# EAGLE schematic harp timestamp generator Gen3 (EAGLE 9.6.2)
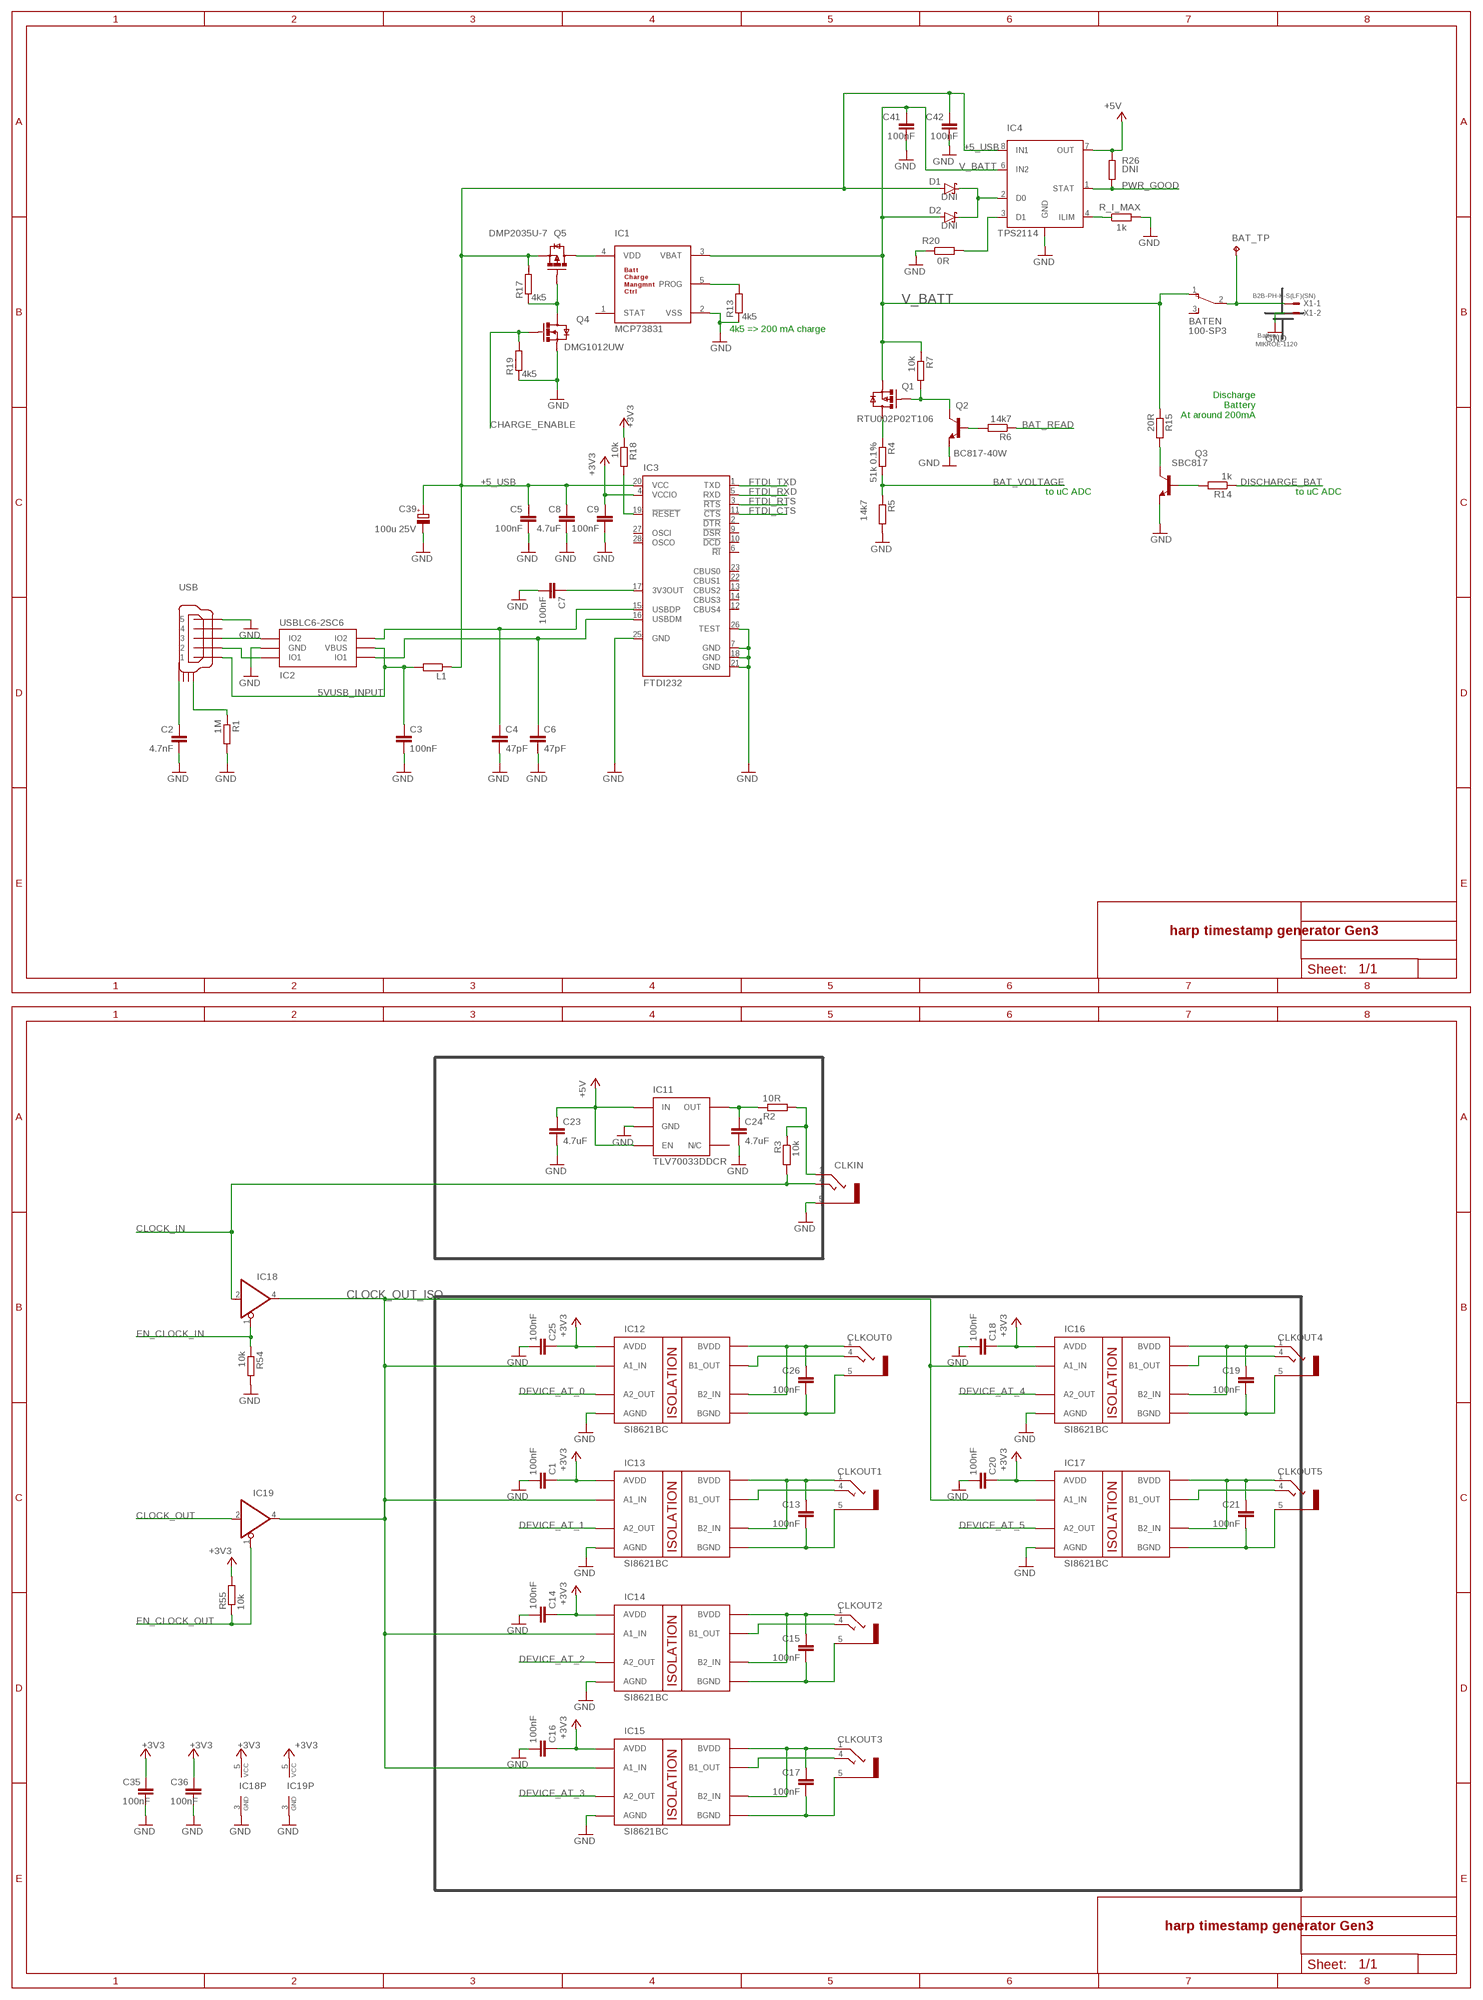
[diagram p0: schematic, sheet 1, part 1 of 2]
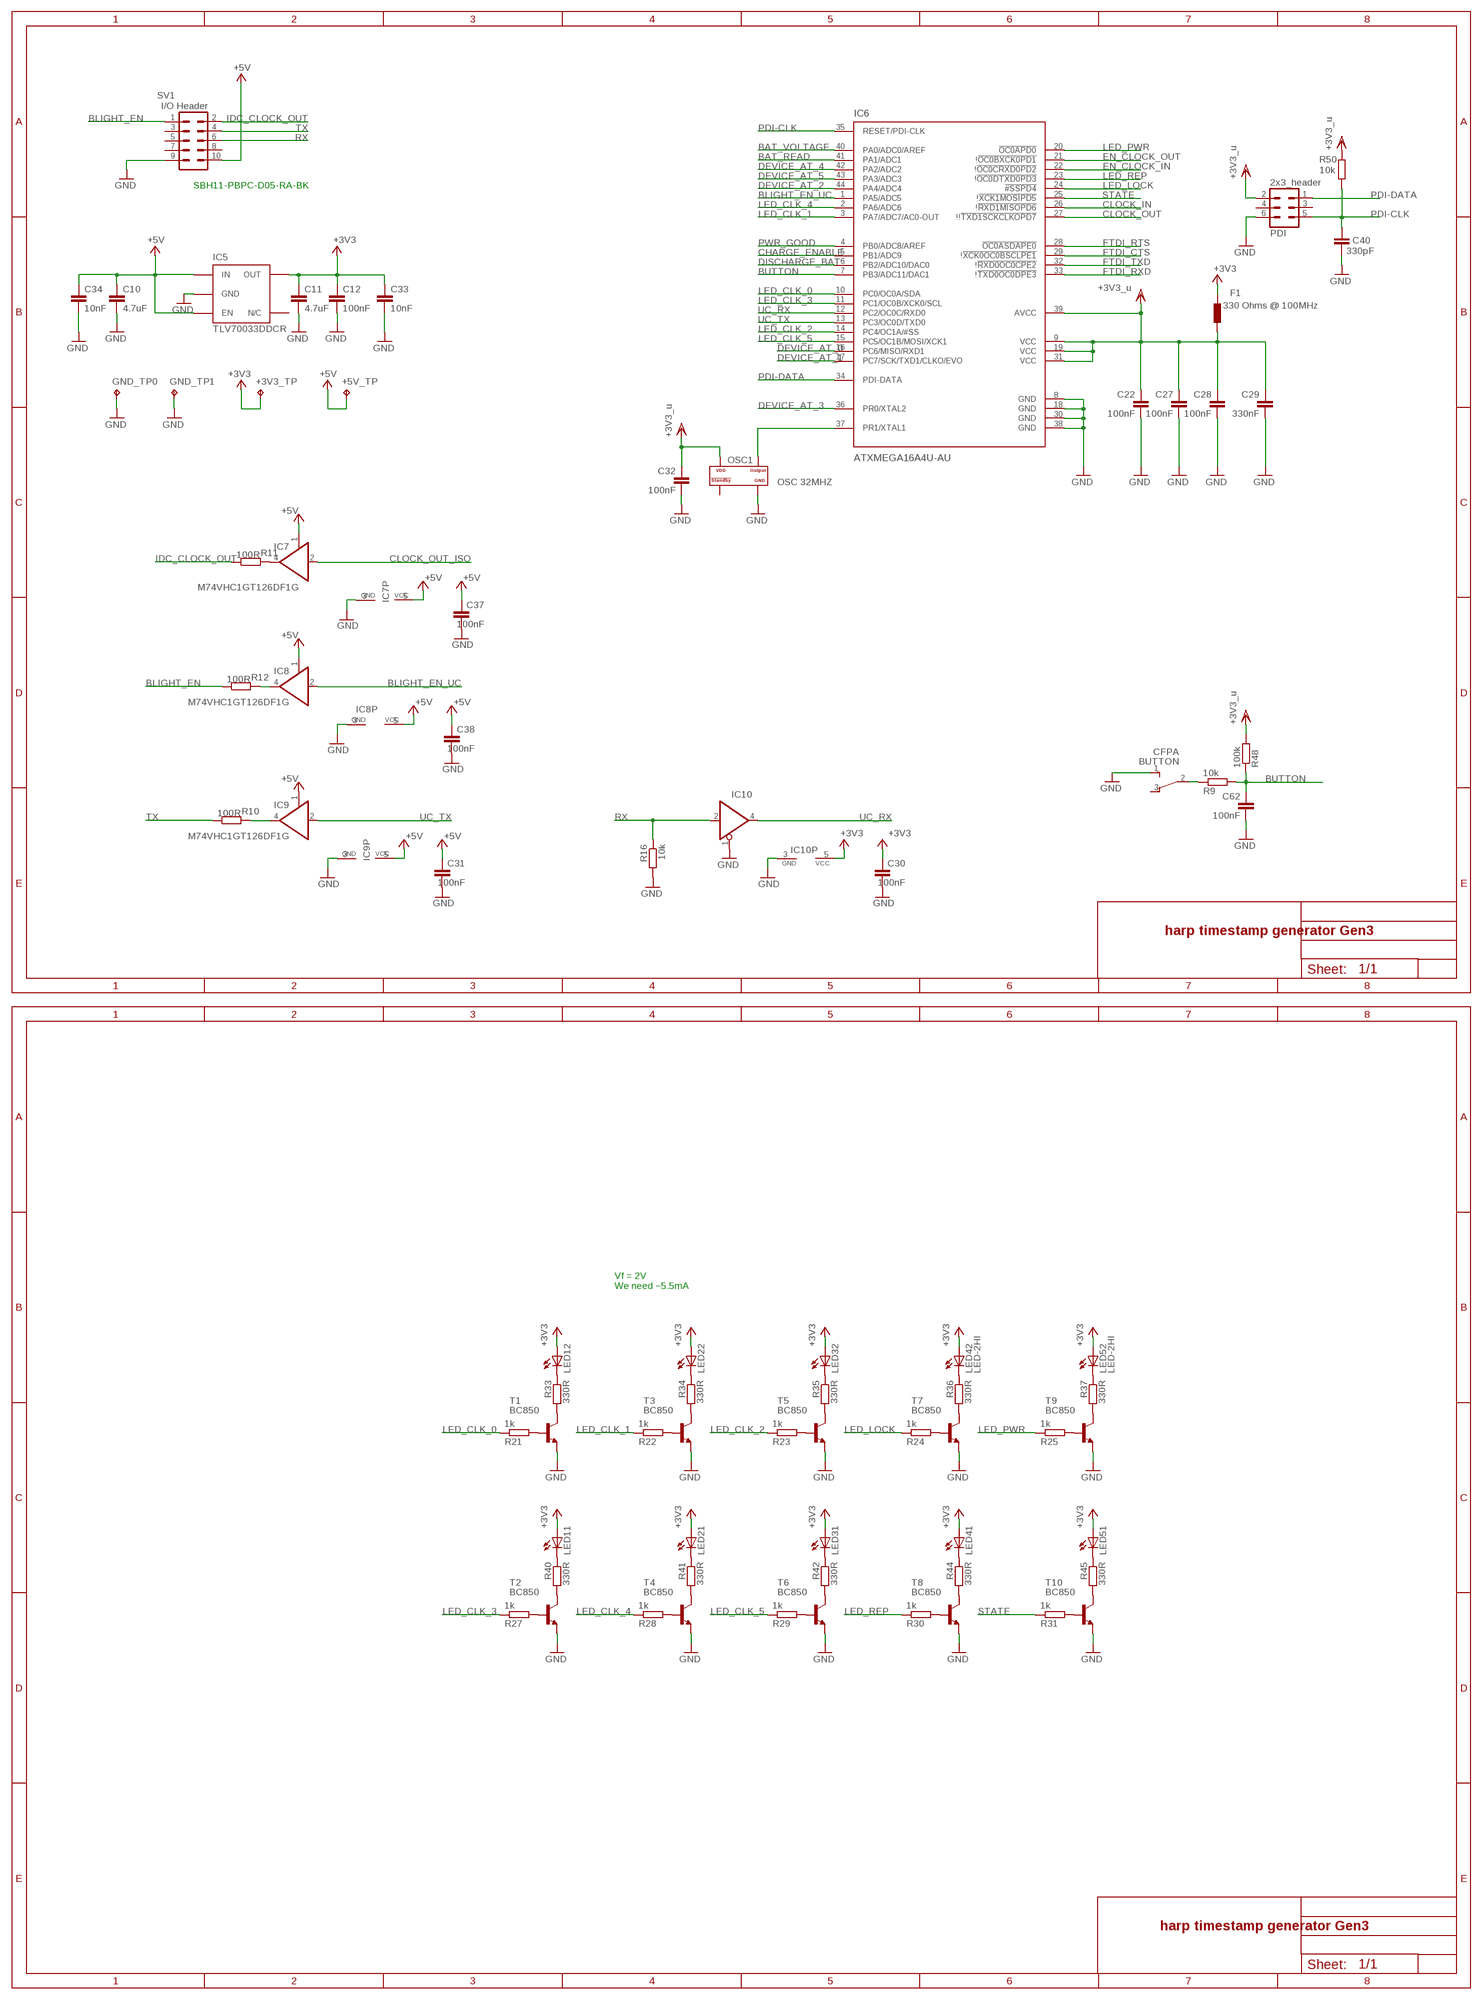
[diagram p1: schematic, sheet 1, part 2 of 2]

## Parts
+3V3_TP  TPPAD1-13  [P1-13]
+5V_TP  TPPAD1-13  [P1-13]
BAT_TP  TPPAD1-13  [P1-13]
BATEN  100-SP3  SPDT_2M-WITHOFF  [2M1-SP1-T2-B4-M6RE]
BUTTON  CFPA  SPDT_CFPA  [CFPA]
C1  100nF  C-EUC0402  [C0402]
C2  4.7nF  C-EUC0402  [C0402]
C3  100nF  C-EUC0402  [C0402]
C4  47pF  C-EUC0402  [C0402]
C5  100nF  C-EUC0402  [C0402]
C6  47pF  C-EUC0402  [C0402]
C7  100nF  C-EUC0402  [C0402]
C8  4.7uF  C-EUC0603  [C0603]
C9  100nF  C-EUC0402  [C0402]
C10  4.7uF  C-EUC0603  [C0603]
C11  4.7uF  C-EUC0603  [C0603]
C12  100nF  C-EUC0402  [C0402]
C13  100nF  C-EUC0402  [C0402]
C14  100nF  C-EUC0402  [C0402]
C15  100nF  C-EUC0402  [C0402]
C16  100nF  C-EUC0402  [C0402]
C17  100nF  C-EUC0402  [C0402]
C18  100nF  C-EUC0402  [C0402]
C19  100nF  C-EUC0402  [C0402]
C20  100nF  C-EUC0402  [C0402]
C21  100nF  C-EUC0402  [C0402]
C22  100nF  C-EUC0402  [C0402]
C23  4.7uF  C-EUC0603  [C0603]
C24  4.7uF  C-EUC0603  [C0603]
C25  100nF  C-EUC0402  [C0402]
C26  100nF  C-EUC0402  [C0402]
C27  100nF  C-EUC0402  [C0402]
C28  100nF  C-EUC0402  [C0402]
C29  330nF  C-EUC0402  [C0402]
C30  100nF  C-EUC0402  [C0402]
C31  100nF  C-EUC0402  [C0402]
C32  100nF  C-EUC0402  [C0402]
C33  10nF  C-EUC0402  [C0402]
C34  10nF  C-EUC0402  [C0402]
C35  100nF  C-EUC0402  [C0402]
C36  100nF  C-EUC0402  [C0402]
C37  100nF  C-EUC0402  [C0402]
C38  100nF  C-EUC0402  [C0402]
C39  100u 25V  CPOL-EUTT2D6  [TT2D6]
C40  330pF  C-EUC0402  [C0402]
C41  100nF  C-EUC0402  [C0402]
C42  100nF  C-EUC0402  [C0402]
C62  100nF  C-EUC0402  [C0402]
CLKIN  CLCK_JACK  STEREO_JACK  [35RASMT2BHNTRX]
CLKOUT0  CLCK_JACK  STEREO_JACK  [35RASMT2BHNTRX]
CLKOUT1  CLCK_JACK  STEREO_JACK  [35RASMT2BHNTRX]
CLKOUT2  CLCK_JACK  STEREO_JACK  [35RASMT2BHNTRX]
CLKOUT3  CLCK_JACK  STEREO_JACK  [35RASMT2BHNTRX]
CLKOUT4  CLCK_JACK  STEREO_JACK  [35RASMT2BHNTRX]
CLKOUT5  CLCK_JACK  STEREO_JACK  [35RASMT2BHNTRX]
D1  DNI  MBRM120  [SOD3715X135]
D2  DNI  MBRM120  [SOD3715X135]
F1  330 Ohms @ 100MHz  BLM15HF0603  [R0603]
GND_TP0  TPPAD1-13  [P1-13]
GND_TP1  TPPAD1-13  [P1-13]
IC1  MCP73831  MCP73831T-2ATI/OT  [TSOT23-5]
IC2  USBLC6-2SC6  USBLC6-2  [SOT23-6L]
IC3  FTDI232  FT232RL  [SSOP28]
IC4  TPS2114  [TSSOP8]
IC5  TLV70033DDCR  TLV700XX  [TSOT23-5]
IC6  ATXMEGA16A4U-AU  AT-XMEGA-XXA4-AU  [QFP80P1200X1200X120-44N]
IC7  M74VHC1GT126DF1G  74AHC1G126DCK  [SC70-5]
IC8  M74VHC1GT126DF1G  74AHC1G126DCK  [SC70-5]
IC9  M74VHC1GT126DF1G  74AHC1G126DCK  [SC70-5]
IC10  SN74LVC1G125DBVT  74AHC1G125DBV  [SOT23-5]
IC11  TLV70033DDCR  TLV700XX  [TSOT23-5]
IC12  SI8621BC  SI8621BC-B-IS  [SOIC8]
IC13  SI8621BC  SI8621BC-B-IS  [SOIC8]
IC14  SI8621BC  SI8621BC-B-IS  [SOIC8]
IC15  SI8621BC  SI8621BC-B-IS  [SOIC8]
IC16  SI8621BC  SI8621BC-B-IS  [SOIC8]
IC17  SI8621BC  SI8621BC-B-IS  [SOIC8]
IC18  SN74LVC1G125DBVT  74AHC1G125DBV  [SOT23-5]
IC19  SN74LVC1G125DBVT  74AHC1G125DBV  [SOT23-5]
L1  40R@100MHz  R-EU_R0805  [R0805]
LED1  LED-2HI  LED_2X_VERTICAL  [569-011X-X00_LED_ARRAY]
LED2  LED-2HI  LED_2X_VERTICAL  [569-011X-X00_LED_ARRAY]
LED3  LED-2HI  LED_2X_VERTICAL  [569-011X-X00_LED_ARRAY]
LED4  LED-2HI  LED_2X_VERTICAL  [569-011X-X00_LED_ARRAY]
LED5  LED-2HI  LED_2X_VERTICAL  [569-011X-X00_LED_ARRAY]
OSC1  OSC 32MHZ  OSCILLATOR  [OSCILLATOR_3.2X2.5]
PDI  2x3_header  MA03-2  [MA03-2]
Q1  RTU002P02T106  MOSFET-PCHANNEL-ROHM  [SOT323]
Q2  BC817-40W  BC817  [SOT323-BEC]
Q3  SBC817  BC817-40LT1SMD  [SOT23-BEC]
Q4  DMG1012UW  [SOT323]
Q5  DMP2035U-7  [SOT323]
R1  1M  R-EU_R0402  [R0402]
R2  10R  R-EU_R0402  [R0402]
R3  10k  R-EU_R0402  [R0402]
R4  51k 0.1%  R-EU_R0402  [R0402]
R5  14k7  R-EU_R0402  [R0402]
R6  14k7  R-EU_R0402  [R0402]
R7  10k  R-EU_R0402  [R0402]
R9  10k  R-EU_R0402  [R0402]
R10  100R  R-EU_R0603  [R0603]
R11  100R  R-EU_R0603  [R0603]
R12  100R  R-EU_R0603  [R0603]
R13  4k5  R-EU_R0402  [R0402]
R14  1k  R-EU_R0402  [R0402]
R15  20R  R-EU_R2512  [R2512]
R16  10k  R-EU_R0402  [R0402]
R17  4k5  R-EU_R0402  [R0402]
R18  10k  R-EU_R0402  [R0402]
R19  4k5  R-EU_R0402  [R0402]
R20  0R  R-EU_R0402  [R0402]
R21  1k  R-EU_R0402  [R0402]
R22  1k  R-EU_R0402  [R0402]
R23  1k  R-EU_R0402  [R0402]
R24  1k  R-EU_R0402  [R0402]
R25  1k  R-EU_R0402  [R0402]
R26  DNI  R-EU_R0402  [R0402]
R27  1k  R-EU_R0402  [R0402]
R28  1k  R-EU_R0402  [R0402]
R29  1k  R-EU_R0402  [R0402]
R30  1k  R-EU_R0402  [R0402]
R31  1k  R-EU_R0402  [R0402]
R33  330R  R-EU_R0402  [R0402]
R34  330R  R-EU_R0402  [R0402]
R35  330R  R-EU_R0402  [R0402]
R36  330R  R-EU_R0402  [R0402]
R37  330R  R-EU_R0402  [R0402]
R40  330R  R-EU_R0402  [R0402]
R41  330R  R-EU_R0402  [R0402]
R42  330R  R-EU_R0402  [R0402]
R44  330R  R-EU_R0402  [R0402]
R45  330R  R-EU_R0402  [R0402]
R48  100k  R-EU_R0402  [R0402]
R50  10k  R-EU_R0402  [R0402]
R54  10k  R-EU_R0402  [R0402]
R55  10k  R-EU_R0402  [R0402]
R_I_MAX  1k  R-EU_R0402  [R0402]
SV1  I/O Header  ML10L  [ML10L]
T1  BC850  [SOT23]
T2  BC850  [SOT23]
T3  BC850  [SOT23]
T4  BC850  [SOT23]
T5  BC850  [SOT23]
T6  BC850  [SOT23]
T7  BC850  [SOT23]
T8  BC850  [SOT23]
T9  BC850  [SOT23]
T10  BC850  [SOT23]
USB  mini USB  USB_MINI_B  [240-0002-1]
X1  B2B-PH-K-S(LF)(SN)  JST-XH-02-PIN-ROUND-PAD  [JST-XH-02-PACKAGE-ROUND-PAD]

## Nets
5VUSB_INPUT: C3.1 IC2.P$5(VBUS) L1.2 USB.P$1
+3V3: +3V3_TP.TP C1.1 C9.1 C11.1 C12.1 C14.1 C16.1 C18.1 C20.1 C25.1 C30.1 C33.1 C35.1 C36.1 F1.2 IC3.4(VCCIO) IC5.5(OUT) IC10.5(VCC) IC12.1(AVDD) IC13.1(AVDD) IC14.1(AVDD) IC15.1(AVDD) IC16.1(AVDD) IC17.1(AVDD) IC18.5(VCC) IC19.5(VCC) LED1.A1(1:A) LED1.A2(2:A) LED2.A1(1:A) LED2.A2(2:A) LED3.A1(1:A) LED3.A2(2:A) LED4.A1(1:A) LED4.A2(2:A) LED5.A1(1:A) LED5.A2(2:A) R18.1 R55.2
+5_USB: C5.1 C8.1 C39.+ C42.1 D1.2(A) IC3.20(VCC) IC4.8(IN1) L1.1 Q5.1(S) R17.2
+5V: +5V_TP.TP C10.1 C23.1 C31.1 C34.1 C37.1 C38.1 IC4.7(OUT) IC5.1(IN) IC5.3(EN) IC7.1(OE) IC7.5(VCC) IC8.1(OE) IC8.5(VCC) IC9.1(OE) IC9.5(VCC) IC11.1(IN) IC11.3(EN) R26.1 SV1.10
BAT_READ: IC6.41(PA1/ADC1) R6.1
BAT_VOLTAGE: IC6.40(PA0/ADC0/AREF) R4.2 R5.1
BLIGHT_EN: R12.1 SV1.1
BLIGHT_EN_UC: IC6.1(PA5/ADC5) IC8.2(I)
BUTTON: C62.1 IC6.7(PB3/ADC11/DAC1) R9.2 R48.1
CHARGE_ENABLE: IC6.5(PB1/ADC9) Q4.2(G) R19.2
CLKOUT0: CLKOUT0.4 IC12.7(B1_OUT)
CLKOUT1: CLKOUT1.4 IC13.7(B1_OUT)
CLKOUT2: CLKOUT2.4 IC14.7(B1_OUT)
CLKOUT3: CLKOUT3.4 IC15.7(B1_OUT)
CLKOUT4: CLKOUT4.4 IC16.7(B1_OUT)
CLKOUT5: CLKOUT5.4 IC17.7(B1_OUT)
CLOCK_IN: CLKIN.4 IC6.26(!!RXD1MISOPD6) IC18.2(I) R3.2
CLOCK_OUT: IC6.27(!!!TXD1SCKCLKOPD7) IC19.2(I)
CLOCK_OUT_ISO: IC7.2(I) IC12.2(A1_IN) IC13.2(A1_IN) IC14.2(A1_IN) IC15.2(A1_IN) IC16.2(A1_IN) IC17.2(A1_IN) IC18.4(O) IC19.4(O)
DEVICE_AT_0: IC6.16(PC6/MISO/RXD1) IC12.3(A2_OUT)
DEVICE_AT_1: IC6.17(PC7/SCK/TXD1/CLKO/EVO) IC13.3(A2_OUT)
DEVICE_AT_2: IC6.44(PA4/ADC4) IC14.3(A2_OUT)
DEVICE_AT_3: IC6.36(PR0/XTAL2) IC15.3(A2_OUT)
DEVICE_AT_4: IC6.42(PA2/ADC2) IC16.3(A2_OUT)
DEVICE_AT_5: IC6.43(PA3/ADC3) IC17.3(A2_OUT)
DISCHARGE_BAT: IC6.6(PB2/ADC10/DAC0) R14.1
EN_CLOCK_IN: IC6.22(!!OC0CRXD0PD2) IC18.1(OE) R54.1
EN_CLOCK_OUT: IC6.21(!!OC0BXCK0PD1) IC19.1(OE) R55.1
FTDI_CTS: IC3.11(!CTS) IC6.29(!!XCK0OC0BSCLPE1)
FTDI_RTS: IC3.3(!RTS) IC6.28(!OC0ASDAPE0)
FTDI_RXD: IC3.5(RXD) IC6.33(!!TXD0OC0DPE3)
FTDI_TXD: IC3.1(TXD) IC6.32(!!RXD0OC0CPE2)
GND: BUTTON.1 C1.2 C2.2 C3.2 C4.2 C5.2 C6.2 C7.2 C8.2 C9.2 C10.2 C11.2 C12.2 C14.2 C16.2 C18.2 C20.2 C22.2 C23.2 C24.2 C25.2 C27.2 C28.2 C29.2 C30.2 C31.2 C32.2 C33.2 C34.2 C35.2 C36.2 C37.2 C38.2 C39.- C40.2 C41.2 C42.2 C62.2 CLKIN.5 GND_TP0.TP GND_TP1.TP IC1.2(VSS) IC2.P$2(GND) IC3.7(GND) IC3.18(GND) IC3.21(GND) IC3.25(GND) IC3.26(TEST) IC4.5(GND) IC5.2(GND) IC6.8(GND) IC6.18(GND) IC6.30(GND) IC6.38(GND) IC7.3(GND) IC8.3(GND) IC9.3(GND) IC10.1(OE) IC10.3(GND) IC11.2(GND) IC12.4(AGND) IC13.4(AGND) IC14.4(AGND) IC15.4(AGND) IC16.4(AGND) IC17.4(AGND) IC18.3(GND) IC19.3(GND) OSC1.P$2(GND) PDI.6 Q2.E Q3.E Q4.1(S) R1.2 R5.2 R13.1 R16.2 R19.1 R20.1 R54.2 R_I_MAX.2 SV1.9 T1.2(E) T2.2(E) T3.2(E) T4.2(E) T5.2(E) T6.2(E) T7.2(E) T8.2(E) T9.2(E) T10.2(E) USB.P$5 X1.2
GND_ISO: C26.2 CLKOUT0.5 IC12.5(BGND)
GND_ISO1: C13.2 CLKOUT1.5 IC13.5(BGND)
GND_ISO2: C15.2 CLKOUT2.5 IC14.5(BGND)
GND_ISO3: C17.2 CLKOUT3.5 IC15.5(BGND)
GND_ISO4: C19.2 CLKOUT4.5 IC16.5(BGND)
GND_ISO5: C21.2 CLKOUT5.5 IC17.5(BGND)
IDC_CLOCK_OUT: R11.1 SV1.2
LED_CLK_0: IC6.10(PC0/OC0A/SDA) R21.1
LED_CLK_1: IC6.3(PA7/ADC7/AC0-OUT) R22.1
LED_CLK_2: IC6.14(PC4/OC1A/#SS) R23.1
LED_CLK_3: IC6.11(PC1/OC0B/XCK0/SCL) R27.1
LED_CLK_4: IC6.2(PA6/ADC6) R28.1
LED_CLK_5: IC6.15(PC5/OC1B/MOSI/XCK1) R29.1
LED_LOCK: IC6.24(!#SSPD4) R24.1
LED_PWR: IC6.20(!OC0APD0) R25.1
LED_REP: IC6.23(!!OC0DTXD0PD3) R30.1
N$1: R24.2 T7.1(B)
N$2: Q4.3(D) Q5.2(G) R17.1
N$3: IC8.4(O) R12.2
N$4: IC9.4(O) R10.2
N$5: C26.1 CLKOUT0.1 IC12.6(B2_IN) IC12.8(BVDD)
N$6: C13.1 CLKOUT1.1 IC13.6(B2_IN) IC13.8(BVDD)
N$7: R36.2 T7.3(C)
N$8: IC7.4(O) R11.2
N$10: IC1.4(VDD) Q5.3(D)
N$11: C15.1 CLKOUT2.1 IC14.6(B2_IN) IC14.8(BVDD)
N$15: R22.2 T3.1(B)
N$16: IC1.5(PROG) R13.2
N$17: R21.2 T1.1(B)
N$18: LED3.C1(1:C) R42.1
N$19: R33.2 T1.3(C)
N$20: R27.2 T2.1(B)
N$21: R34.2 T3.3(C)
N$22: R40.2 T2.3(C)
N$23: LED3.C2(2:C) R35.1
N$24: R28.2 T4.1(B)
N$25: R41.2 T4.3(C)
N$26: R23.2 T5.1(B)
N$27: R35.2 T5.3(C)
N$28: R29.2 T6.1(B)
N$29: R42.2 T6.3(C)
N$30: LED1.C2(2:C) R33.1
N$31: LED2.C2(2:C) R34.1
N$32: LED1.C1(1:C) R40.1
N$33: LED2.C1(1:C) R41.1
N$34: R30.2 T8.1(B)
N$35: Q3.B R14.2
N$36: Q3.C R15.2
N$37: C17.1 CLKOUT3.1 IC15.6(B2_IN) IC15.8(BVDD)
N$38: C7.1 IC3.17(3V3OUT)
N$40: IC2.P$1(IO1) USB.P$2
N$41: CLKIN.1 R2.2 R3.1
N$42: C24.1 IC11.5(OUT) R2.1
N$43: BUTTON.2 R9.1
N$45: C19.1 CLKOUT4.1 IC16.6(B2_IN) IC16.8(BVDD)
N$47: R44.2 T8.3(C)
N$49: C21.1 CLKOUT5.1 IC17.6(B2_IN) IC17.8(BVDD)
N$50: IC2.P$3(IO2) USB.P$3
N$53: R25.2 T9.1(B)
N$54: R37.2 T9.3(C)
N$56: R31.2 T10.1(B)
N$59: C2.1 USB.SHIELD_4
N$60: R45.2 T10.3(C)
N$61: R1.1 USB.SHIELD_1
N$62: LED5.C1(1:C) R45.1
N$63: LED5.C2(2:C) R37.1
N$65: LED4.C2(2:C) R36.1
N$66: LED4.C1(1:C) R44.1
N$82: BAT_TP.TP BATEN.2 X1.1
N$113: Q1.3(D) R4.1
N$114: IC4.4(ILIM) R_I_MAX.1
N$116: Q1.2(G) Q2.C R7.2
N$118: Q2.B R6.2
N$139: D1.1(C) D2.1(C) IC4.2(D0)
N$140: IC4.3(D1) R20.2
N$175: IC3.19(!RESET) R18.2
OSC1: IC6.37(PR1/XTAL1) OSC1.P$3(OUTPUT)
PDI-CLK: C40.1 IC6.35(RESET/PDI-CLK) PDI.5 R50.1
PDI-DATA: IC6.34(PDI-DATA) PDI.1
PWR_GOOD: IC4.1(STAT) IC6.4(PB0/ADC8/AREF) R26.2
RX: IC10.2(I) R16.1 SV1.6
STATE: IC6.25(!!XCK1MOSIPD5) R31.1
TX: R10.1 SV1.4
UC_RX: IC6.12(PC2/OC0C/RXD0) IC10.4(O)
UC_TX: IC6.13(PC3/OC0D/TXD0) IC9.2(I)
USBDM: C6.1 IC2.P$6(IO1) IC3.16(USBDM)
USBDP: C4.1 IC2.P$4(IO2) IC3.15(USBDP)
V_BATT: BATEN.1 C41.1 D2.2(A) IC1.3(VBAT) IC4.6(IN2) Q1.1(S) R7.1 R15.1
VDD: C22.1 C27.1 C28.1 C29.1 C32.1 F1.1 IC6.9(VCC) IC6.19(VCC) IC6.31(VCC) IC6.39(AVCC) OSC1.P$4(VDD) PDI.2 R48.2 R50.2 ; supply symbol labelled +3V3_u
Unconnected: BATEN.3 BUTTON.3 IC1.1(STAT) IC3.2(!DTR) IC3.6(!RI) IC3.9(!DSR) IC3.10(!DCD) IC3.12(CBUS4) IC3.13(CBUS2) IC3.14(CBUS3) IC3.22(CBUS1) IC3.23(CBUS0) IC3.27(OSCI) IC3.28(OSCO) IC5.4(N/C) IC11.4(N/C) OSC1.P$1(STANDBY#) PDI.3 PDI.4 SV1.3 SV1.5 SV1.7 SV1.8 USB.P$4 USB.SHIELD_2 USB.SHIELD_3

## Notes on the sheet
- SBH11-PBPC-D05-RA-BK
- 4k5 => 200 mA charge
- Battery
- MIKROE-1120
- Discharge
  Battery
  At around 200mA
- to uC ADC | to uC ADC
- Vf = 2V
  We need ~5.5mA

## Library data of the parts
+3V3_TP +5V_TP BAT_TP GND_TP0 GND_TP1 = testpad:TP: Test pad; MPN: n.a.
BATEN = cyclops:SPDT: SPDT Switch; DIGIKEY_PN: CKN1045-ND Mouser: 611-7101-051; MPN: 7101MD9ABE
BUTTON = harp timestamp generator Gen3:SPDT: SPDT Switch; DIGIKEY_PN: 563-1246-1-ND; MPN: CFPA-1FB4-A2T
C1 C3 C5 C7 C9 C12-C22 C25-C28 C30-C32 C35-C38 C41 C42 C62 = rcl:C-EU: CAPACITOR, European symbol; DIGIKEY_PN: 445-6899-2-ND; MPN: CGA2B3X7R1H104K050BB
C2 = rcl:C-EU: CAPACITOR, European symbol; DIGIKEY_PN: 587-2237-1-ND; MPN: UMK105B7472KV-F
C4 C6 = rcl:C-EU: CAPACITOR, European symbol; DIGIKEY_PN: 478-1078-1-ND; MPN: 04025A470JAT2A
C8 C10 C11 C23 C24 = rcl:C-EU: CAPACITOR, European symbol; DIGIKEY_PN: 587-2786-1-ND; MPN: EMK107ABJ475KA-T
C29 = rcl:C-EU: CAPACITOR, European symbol; DIGIKEY_PN: 490-3263-1-ND; MPN: GRM155R61A334KE15D
C33 C34 = rcl:C-EU: CAPACITOR, European symbol; DIGIKEY_PN: 1276-1028-1-ND; MPN: CL05B103KB5NNNC
C39 = rcl:CPOL-EU: POLARIZED CAPACITOR, European symbol; DIGIKEY_PN: P19702CT-ND; MPN: EEUFM1E101B
C40 = rcl:C-EU: CAPACITOR, European symbol; DIGIKEY_PN: 399-11875-1-ND; MPN: C0402C331JAGAC7867
CLKIN CLKOUT0 CLKOUT1-CLKOUT5 = harp timestamp generator Gen3:STEREO_JACK: CONN JACK STEREO 3.5MM SMD R/A; DIGIKEY_PN: SC1489-1-ND; MPN: 35RASMT2BHNTRX
D1 D2 = harp timestamp generator Gen3:MBRM120: DIODE SCHOTTKY 20V 1A POWERMITE; DIGIKEY_PN: -; MPN: -
F1 = harp timestamp generator Gen3:BLM15H: EMIFIL (R) Chip Ferrite Bead for GHz Noise Source: http://www.murata.com/ Ferrite Bead BLM15H.pdf; DIGIKEY_PN: 490-3997-1-ND; MPN: BLM18SG331TN1D
IC1 = harp timestamp generator Gen3:MCP73831T-2ATI/OT: Miniature Single-Cell, Fully Integrated Li-Ion, Li-Polymer Charge Management Controllers; DIGIKEY_PN: MCP73831T-2ATI/OTCT-ND; MPN: MCP73831T-2ATI/OT
IC2 = harp timestamp generator Gen3:USBLC6-2: TVS DIODE 5.25VWM 17VC SOT23-6; DIGIKEY_PN: 497-5235-1-ND; MPN: USBLC6-2SC6
IC3 = harp timestamp generator Gen3:FT232R: UART/FIFO IC; DIGIKEY_PN: 768-1007-1-ND; MPN: FT232RL-REEL
IC4 = harp timestamp generator Gen3:TPS2114: AUTOSWITCHING POWER MULTIPLEXER Two-Input, One-Output Power Multiplexer Operating Voltage Range: 2.8 V to 5.5 V Adjustable Current Limit; DIGIKEY_PN: 296-16939-1-ND; MPN: TPS2114APWR
IC5 IC11 = harp timestamp generator Gen3:TLV700XX: IC REG LINEAR 3.3V 200MA SOT23-5; DIGIKEY_PN: 296-27937-6-ND; MPN: TLV70033DDCR
IC6 = harp timestamp generator Gen3:AT-XMEGA-XXA4-AU: ATxMega a4 Serie; DIGIKEY_PN: ATXMEGA16A4U-AU-ND; MPN: ATXMEGA16A4U-AU
IC7-IC9 = 74xx-little-de:74*1G126: Single Bus Buffer Gate With 3-State Outputs; DIGIKEY_PN: M74VHC1GT126DF1GOSCT-ND; MPN: M74VHC1GT126DF1G
IC10 IC18 IC19 = 74xx-little-de:74*1G125: Single Bus Buffer Gate with 3-State Output; DIGIKEY_PN: 296-26595-1-ND; MPN: SN74LVC1G125DBVT
IC12-IC17 = harp timestamp generator Gen3:SI8621BC-B-IS: General Purpose Digital Isolator; DIGIKEY_PN: 336-2064-5-ND; MPN: Si8621BC-B-IS
L1 = rcl:R-EU_: RESISTOR, European symbol; DIGIKEY_PN: 240-2389-1-ND; MPN: MI0805K400R-10
LED1-LED5 = harp timestamp generator Gen3:LED_2X: LED 2HI 3MM NARROW RED PC MNT; DIGIKEY_PN: 350-1782-ND; MPN: 5690111100F
OSC1 = harp timestamp generator Gen3:OSCILLATOR: XTAL OSC TCXO 32.0000MHZ; DIGIKEY_PN: 1908-1044-1-ND; MPN: O 32,0-JT32C-A-K-3,3-LF
PDI = con-lstb:MA03-2: PIN HEADER; DIGIKEY_PN: 609-3210-ND; MPN: 67996-206HLF; OC_FARNELL: unknown; OC_NEWARK: unknown
Q1 = harp timestamp generator Gen3:MOSFET-PCHANNEL-ROHM: PMOS (RTU002P02) Low On-Resistance. Low Gate Threshold Voltage. Low Input Capacitance. Fast Switching Speed. Manufacturer: ROHM; DIGIKEY_PN: RTU002P02T106CT-ND; MPN: RTU002P02T106
Q2 = transistor-npn:BC817*: NPN Transistor; DIGIKEY_PN: 1727-6185-1-ND; MPN: BC817-40W,135
Q3 = harp timestamp generator Gen3:BC817*: NPN Transistor; DIGIKEY_PN: SBC817-40LT1GOSCT-ND; MPN: SBC817-40LT1G
Q4 = harp timestamp generator Gen3:DMG1012UW: DMG1012UW N-channel MOSFET Drain Source Voltage Vds: 20V Continuous Drain Current Id: 1A On Resistance Rds(on): 0.3ohm Transistor Case Style: SOT-323 Transistor Mounting: Surface Mount Rds(on) Test Voltage Vgs: 4.5V; DIGIKEY_PN: DMG1012UW-7DICT-ND; MPN: DMG1012UW-7
Q5 = harp timestamp generator Gen3:DMP2035U-7: DMP2035U Diode Inc surface mount, P channel enhancement mode MOSFET in SOT-23 package This device features low on resistance, low input capacitance, fast switching speed and low input/output leakage thus it is ideal for high efficiency power management applications. Drain to source Voltage (Vds) of -20V Gate to source voltage (Vgs) of ±8V Continuous drain current (Id) -3.6A to 25°C Power dissipation (Pd) of 810mW Operating temperature range -55°C to 150°C Low on state resistance of 41mohm at Vgs -1.8V; DIGIKEY_PN: DMP2035U-7DICT-ND; MPN: DMP2035U-7
R1 = rcl:R-EU_: RESISTOR, European symbol; DIGIKEY_PN: 541-3965-1-ND; MPN: CRCW04021M00FKEDC
R2 = rcl:R-EU_: RESISTOR, European symbol; DIGIKEY_PN: 541-10.0YCT-ND; MPN: CRCW040210R0FKEDHP
R3 R7 R9 R16 R18 R50 R54 R55 = rcl:R-EU_: RESISTOR, European symbol; DIGIKEY_PN: RMCF0402FT10K0CT-ND; MPN: RMCF0402FT10K0
R4 = rcl:R-EU_: RESISTOR, European symbol; DIGIKEY_PN: P51KDCCT-ND; MPN: ERA-2AEB513X
R5 R6 = rcl:R-EU_: RESISTOR, European symbol; DIGIKEY_PN: YAG4174CT-ND; MPN: RT0402BRD0714K7L
R10-R12 = rcl:R-EU_: RESISTOR, European symbol; DIGIKEY_PN: 311-100DCT-ND; MPN: RT0603DRD07100RL
R13 R17 R19 = rcl:R-EU_: RESISTOR, European symbol; DIGIKEY_PN: YAG1444CT-ND; MPN: RT0402BRD074K53L
R14 R21-R25 R27-R31 = rcl:R-EU_: RESISTOR, European symbol; DIGIKEY_PN: RMCF0402FT1K00CT-ND; MPN: RMCF0402FT1K00
R15 = rcl:R-EU_: RESISTOR, European symbol; DIGIKEY_PN: 541-2662-1-ND; MPN: RCP2512W25R0GEB
R20 = rcl:R-EU_: RESISTOR, European symbol; DIGIKEY_PN: RMCF0402ZT0R00CT-ND; MPN: RMCF0402ZT0R00
R26 = rcl:R-EU_: RESISTOR, European symbol; DIGIKEY_PN: DNI; MPN: DNI
R33-R37 R40-R42 R44 R45 = rcl:R-EU_: RESISTOR, European symbol; DIGIKEY_PN: 311-330LRCT-ND; MPN: RC0402FR-07330RL
R48 = rcl:R-EU_: RESISTOR, European symbol; DIGIKEY_PN: P15984CT-ND; MPN: ERJ-2RHD1002X
R_I_MAX = rcl:R-EU_: RESISTOR, European symbol; DIGIKEY_PN: RMCF0402FT1K00CT-ND Mouser ERJ-2RKF1001X; MPN: RMCF0402FT1K00
SV1 = harp timestamp generator Gen3:ML10L: HARTING; DIGIKEY_PN: S9177-ND; MPN: SBH11-PBPC-D05-RA-BK
T1-T10 = harp timestamp generator Gen3:BC850: NPN TRANSISTOR; DIGIKEY_PN: 1727-4862-1-ND; MPN: BC850C,215
USB = harp timestamp generator Gen3:USB_MINI_B: USB - mini B USB 2.0 Receptacle Connector; DIGIKEY_PN: H2960TR-ND; MPN: UX60-MB-5S8
X1 = harp timestamp generator Gen3:JST-XH-02-PIN: JST XH Connector 2 Pin Wire to board connector. Pitch: 2,54 mm, (0.100") Number of pins: 2 Created by Rembrandt Electronics www.rembrandtelectronics.com; DIGIKEY_PN: 455-1704-ND; MPN: B2B-PH-K-S(LF)(SN)

## Net classes
0 default: clearance 0.205 mm